# EAGLE design Płytka_ESPv1 (EAGLE 7.7.0)
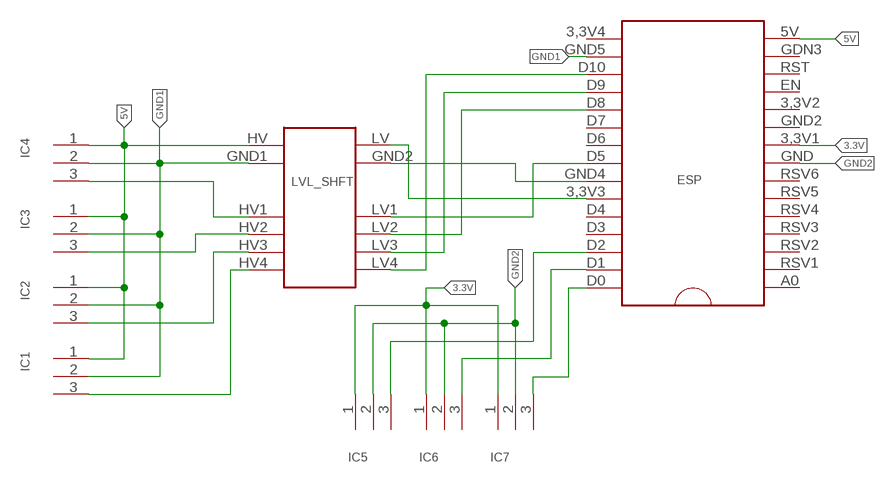
[diagram p0: schematic, sheet 1]

## Parts
ESP  ESP8266_NODEMCUV2  [ESP8266_NODEMCV2]
IC1  3,5MM_3PIN  [3,5MM_3PIN]
IC2  3,5MM_3PIN  [3,5MM_3PIN]
IC3  3,5MM_3PIN  [3,5MM_3PIN]
IC4  3,5MM_3PIN  [3,5MM_3PIN]
IC5  3,5MM_3PIN  [3,5MM_3PIN]
IC6  3,5MM_3PIN  [3,5MM_3PIN]
IC7  3,5MM_3PIN  [3,5MM_3PIN]
LVL_SHFT  LVL_SHIFTER_4CH  [LVL_SHIFTER_4CH]

## Nets
3.3V: ESP.3,3V1 IC5.1 IC6.1 IC7.1
5V: ESP.5V IC1.1 IC2.1 IC3.1 IC4.1 LVL_SHFT.HV
GND1: ESP.GND5 IC1.2 IC2.2 IC3.2 IC4.2 LVL_SHFT.GND1
GND2: ESP.GND IC5.2 IC6.2 IC7.2
N$1: IC4.3 LVL_SHFT.HV1
N$2: IC3.3 LVL_SHFT.HV2
N$3: IC2.3 LVL_SHFT.HV3
N$4: IC1.3 LVL_SHFT.HV4
N$5: ESP.D5 LVL_SHFT.LV1
N$6: ESP.D8 LVL_SHFT.LV2
N$7: ESP.D9 LVL_SHFT.LV3
N$8: ESP.D0 IC7.3
N$9: ESP.GND4 LVL_SHFT.GND2
N$10: ESP.D10 LVL_SHFT.LV4
N$11: ESP.3,3V3 LVL_SHFT.LV
N$12: ESP.D2 IC5.3
N$15: ESP.D1 IC6.3
Unconnected: ESP.3,3V2 ESP.3,3V4 ESP.A0 ESP.D3 ESP.D4 ESP.D6 ESP.D7 ESP.EN ESP.GDN3 ESP.GND2 ESP.RST ESP.RSV1 ESP.RSV2 ESP.RSV3 ESP.RSV4 ESP.RSV5 ESP.RSV6

## Library data of the parts
ESP = esp8266:ESP8266_NODEMCUV2
IC1-IC7 = Screw_connector:3,5MM_3PIN
LVL_SHFT = level_shifter_MOD12:LVL_SHIFTER_4CH

## Board
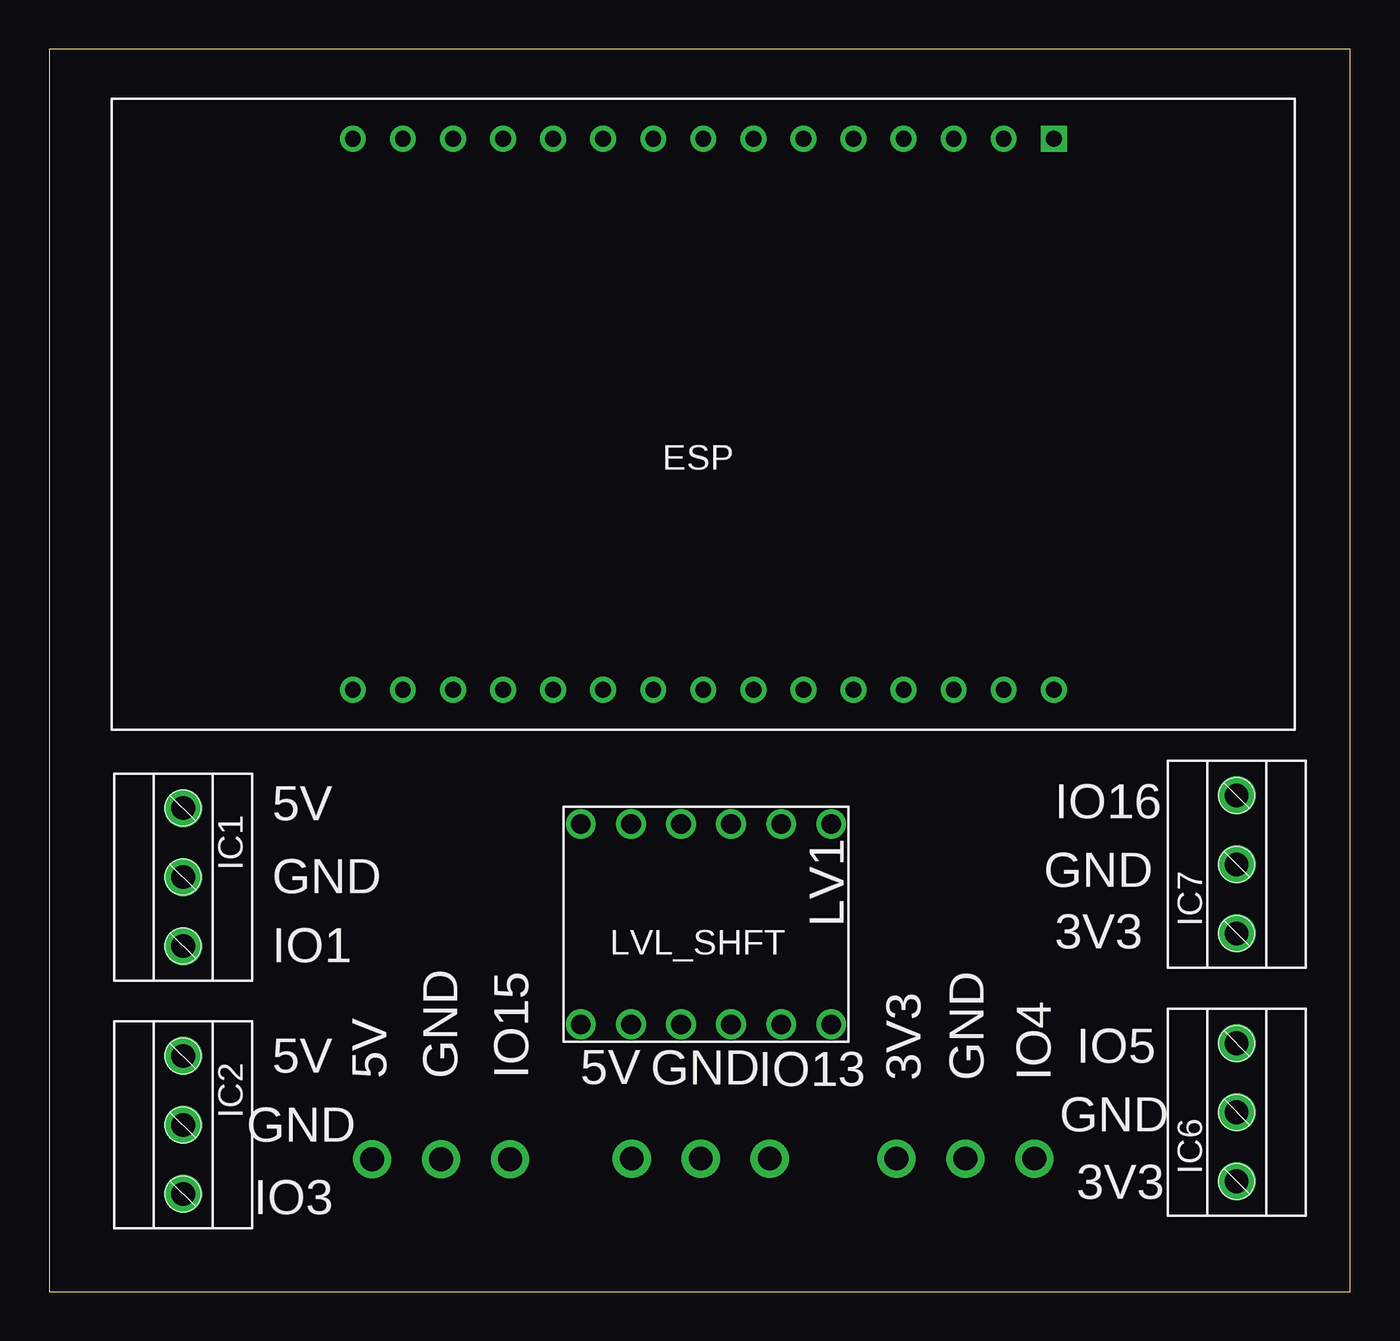
[diagram p1: board, top side]
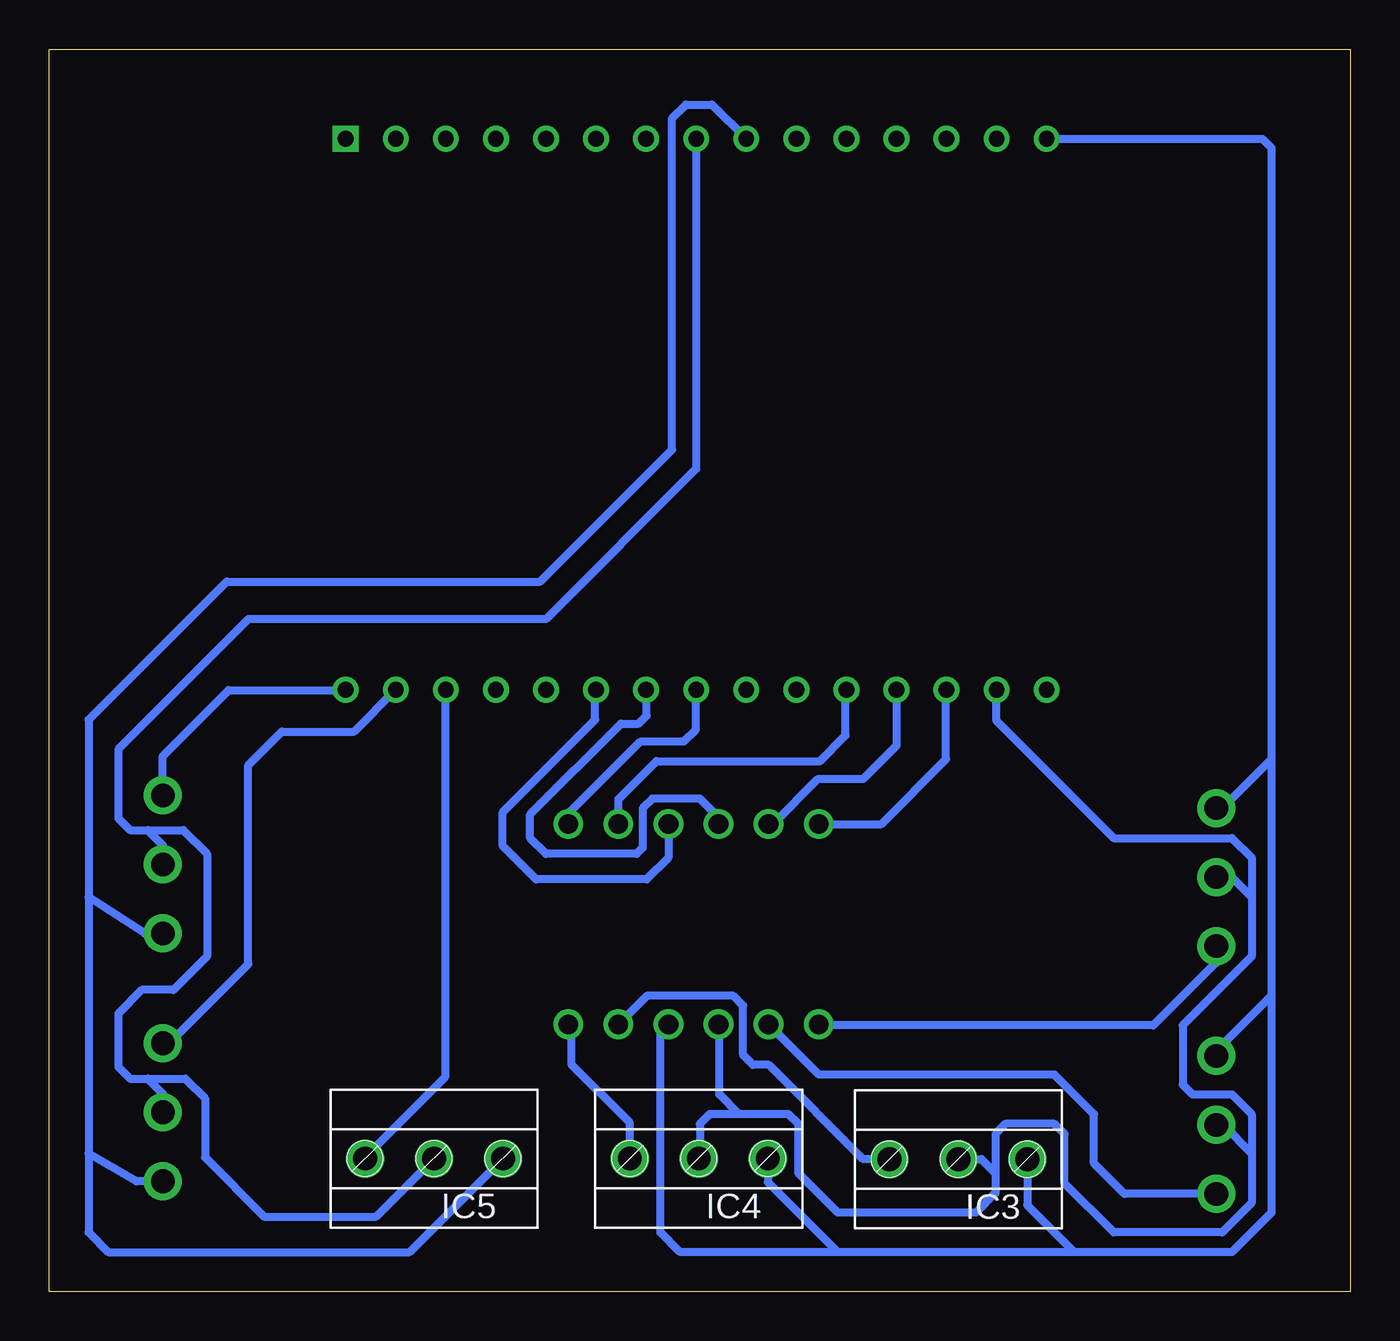
[diagram p2: board, bottom side, seen from below]

Size 66 x 63 mm. Coordinates in mm from the lower left corner, seen from the top.
Outline: 0,0 66,0 66,63 0,63 0,0
Copper layers (1*16): Top 0.035mm / dielectric 1.5mm / Bottom 0.035mm
Design rules "default": minimum track width 10mil, minimum drill 24mil, track to track 8mil, track to pad 8mil, pad to pad 8mil, via to via 8mil, smd to smd 8mil, copper to edge 40mil, drill to drill 8mil, minimum pad ring 10mil, minimum via ring 8mil, stop-mask expansion 4mil, vias tented up to drill 0mil, thermal gap 10mil

### Footprints (pad centres in the part's own frame; a part is rotated, then mirrored left to right if it is on the bottom)
ESP8266_NODEMCV2 = drill 0.8: 3,3V1 2.54,-13.97; 3,3V2 7.62,-13.97; 3,3V3 -5.08,13.97; 3,3V4 17.78,13.97; 5V 17.78,-13.97; D0 -17.78,13.97; D1 -15.24,13.97; D2 -12.7,13.97; D3 -10.16,13.97; D4 -7.62,13.97; D5 0,13.97; D6 2.54,13.97; D7 5.08,13.97; D8 7.62,13.97; D9 10.16,13.97; D10 12.7,13.97; EN 10.16,-13.97; GDN3 15.24,-13.97; GND 0,-13.97; GND2 5.08,-13.97; GND4 -2.54,13.97; GND5 15.24,13.97; RST 12.7,-13.97; RSV1 -15.24,-13.97; RSV2 -12.7,-13.97; RSV3 -10.16,-13.97; RSV4 -7.62,-13.97; RSV5 -5.08,-13.97; RSV6 -2.54,-13.97 | drill 0.8 square: A0 -17.78,-13.97
3,5MM_3PIN = drill 1.2 pad 1.93: 1 -3.5,2; 2 0,2; 3 3.5,2
LVL_SHIFTER_4CH = drill 1: GND1 1.27,5.08; GND2 1.27,-5.08; HV -1.27,5.08; HV1 -6.35,5.08; HV2 -3.81,5.08; HV3 3.81,5.08; HV4 6.35,5.08; LV -1.27,-5.08; LV1 -6.35,-5.08; LV2 -3.81,-5.08; LV3 3.81,-5.08; LV4 6.35,-5.08

### Placement (x,y rotation side)
ESP  33.18,44.49 180 top
IC1  4.79,21.02 270 top
IC2  4.79,8.45 270 top
IC3  19.88,8.71 180 bottom
IC4  33.05,8.74 180 bottom
IC5  46.48,8.74 180 bottom
IC6  62.24,9.09 90 top
IC7  62.24,21.66 90 top
LVL_SHFT  33.32,18.63 180 top

### Tracks (layer width: path | path; a pad name or v marks a point on that pad's centre or on a via)
3.3V
  Bottom 0.406: 64,20 64,29 57,36 41.1,36 34.4,42.7 34.4,59.5 33.7,60.2 32.38,60.2 ESP.3,3V1 | 64,20 64,7 | 64,7 64,3 63,2 47.72,2 IC5.1 | IC6.1 61.59,5.59 64,7 | IC7.1 61.16,18.16 64,20
5V
  Bottom 0.406: ESP.5V 4.46,58.46 4,58 4,27 | 4,27 4,15 | 4,15 4,4 6,2 14,2 | 14,2 26,2 | 26,2 34,2 35,3 35,13.14 LVL_SHFT.HV | IC3.1 16.38,4.38 14,2 | IC2.1 6.79,12.21 4,15 | IC1.1 6.48,24.52 4,27 | IC4.1 29.55,5.55 26,2
GND1
  Bottom 0.406: 5,20 5,22 6,23 12,23 17.94,28.94 ESP.GND5 | 5,20 5,17 8.5,13.5 8.5,10.5 8,10 6,10 5,9 5,7 | 5,7 5,4.5 6.5,3 12,3 14.5,5.5 14.5,8 15,8.5 17.5,8.5 18,8 18,6 | 18,6 18,5 19,4 26,4 28,6 28,8.5 28.5,9 31,9 | 31,9 32,10 32,13.5 LVL_SHFT.GND1 | 31,9 32.5,9 33,8.5 33,6.79 IC4.2 | IC3.2 18.71,6.71 18,6 | IC2.2 6.45,8.45 5,7 | IC1.2 6.02,21.02 5,20
GND2
  Bottom 0.406: ESP.GND 33.18,41.72 40.8,34.1 55.9,34.1 62.5,27.5 62.5,24 61.9,23.4 61,23.4 | 61,23.4 59.2,23.4 58,22.2 58,17 59.7,15.3 61.3,15.3 62.5,14.1 62.5,11.4 61.9,10.8 61,10.8 | 61,10.8 59.1,10.8 58.1,9.8 58.1,6.8 55.1,3.8 49.42,3.8 IC5.2 | IC6.2 60.24,10.04 61,10.8 | IC7.2 60.24,22.64 61,23.4
N$1
  Bottom 0.406: IC4.3 36.55,8.55 39.5,11.5 39.5,13.38 LVL_SHFT.HV1
N$2
  Bottom 0.406: IC3.3 24.71,6.71 29.5,11.5 30.3,11.5 30.8,12 30.8,14.5 31.3,15 35.68,15 LVL_SHFT.HV2
N$3
  Bottom 0.406: IC2.3 11.45,4.95 13,6.5 13,9 15,11 26.96,11 LVL_SHFT.HV3
N$4
  Bottom 0.406: IC1.3 6.79,16.71 10,13.5 26.92,13.5 LVL_SHFT.HV4
N$5
  Bottom 0.406: LVL_SHFT.LV1 39.67,24.23 36,27.9 33.8,27.9 33.2,28.5 33.2,30.5 ESP.D5
N$6
  Bottom 0.406: LVL_SHFT.LV2 37.13,24.97 35.2,26.9 26.9,26.9 25.6,28.2 25.6,30.48 ESP.D8
N$7
  Bottom 0.406: LVL_SHFT.LV3 29.29,23.71 27,26 24.7,26 23,27.7 23,30.5 ESP.D9
N$8
  Bottom 0.406: IC7.3 60.24,27.16 56.9,30.5 50.98,30.5 ESP.D0
N$9
  Bottom 0.406: LVL_SHFT.GND2 32.05,24.05 33,25 35.4,25 35.9,24.5 35.9,22.5 36.2,22.2 40.8,22.2 41.6,23 41.6,24.2 37,28.8 36.1,28.8 35.7,29.2 35.7,30.5 ESP.GND4
N$10
  Bottom 0.406: LVL_SHFT.LV4 23.79,23.71 20.5,27 20.5,30.5 ESP.D10
N$11
  Bottom 0.406: LVL_SHFT.LV 34.59,22.01 35.7,20.9 41.3,20.9 43,22.6 43,24.3 38.3,29 38.3,30.48 ESP.3,3V3
N$12
  Bottom 0.406: IC5.3 49.98,6.82 45.9,10.9 45.9,30.5 ESP.D2
N$15
  Bottom 0.406: IC6.3 59.91,12.59 55.9,16.6 55.9,26.7 54.2,28.4 50.54,28.4 ESP.D1

### Text on the board
tNames: 5V | IO16 | GND | GND | LV1 | IO1 | 3V3 | 5V | IO13 | IO5 | 5V | 5V | GND | IO15 | 3V3 | GND | IO4 | GND | GND | GND | IO3 | 3V3